# EAGLE schematic revB (EAGLE 9.6.2)
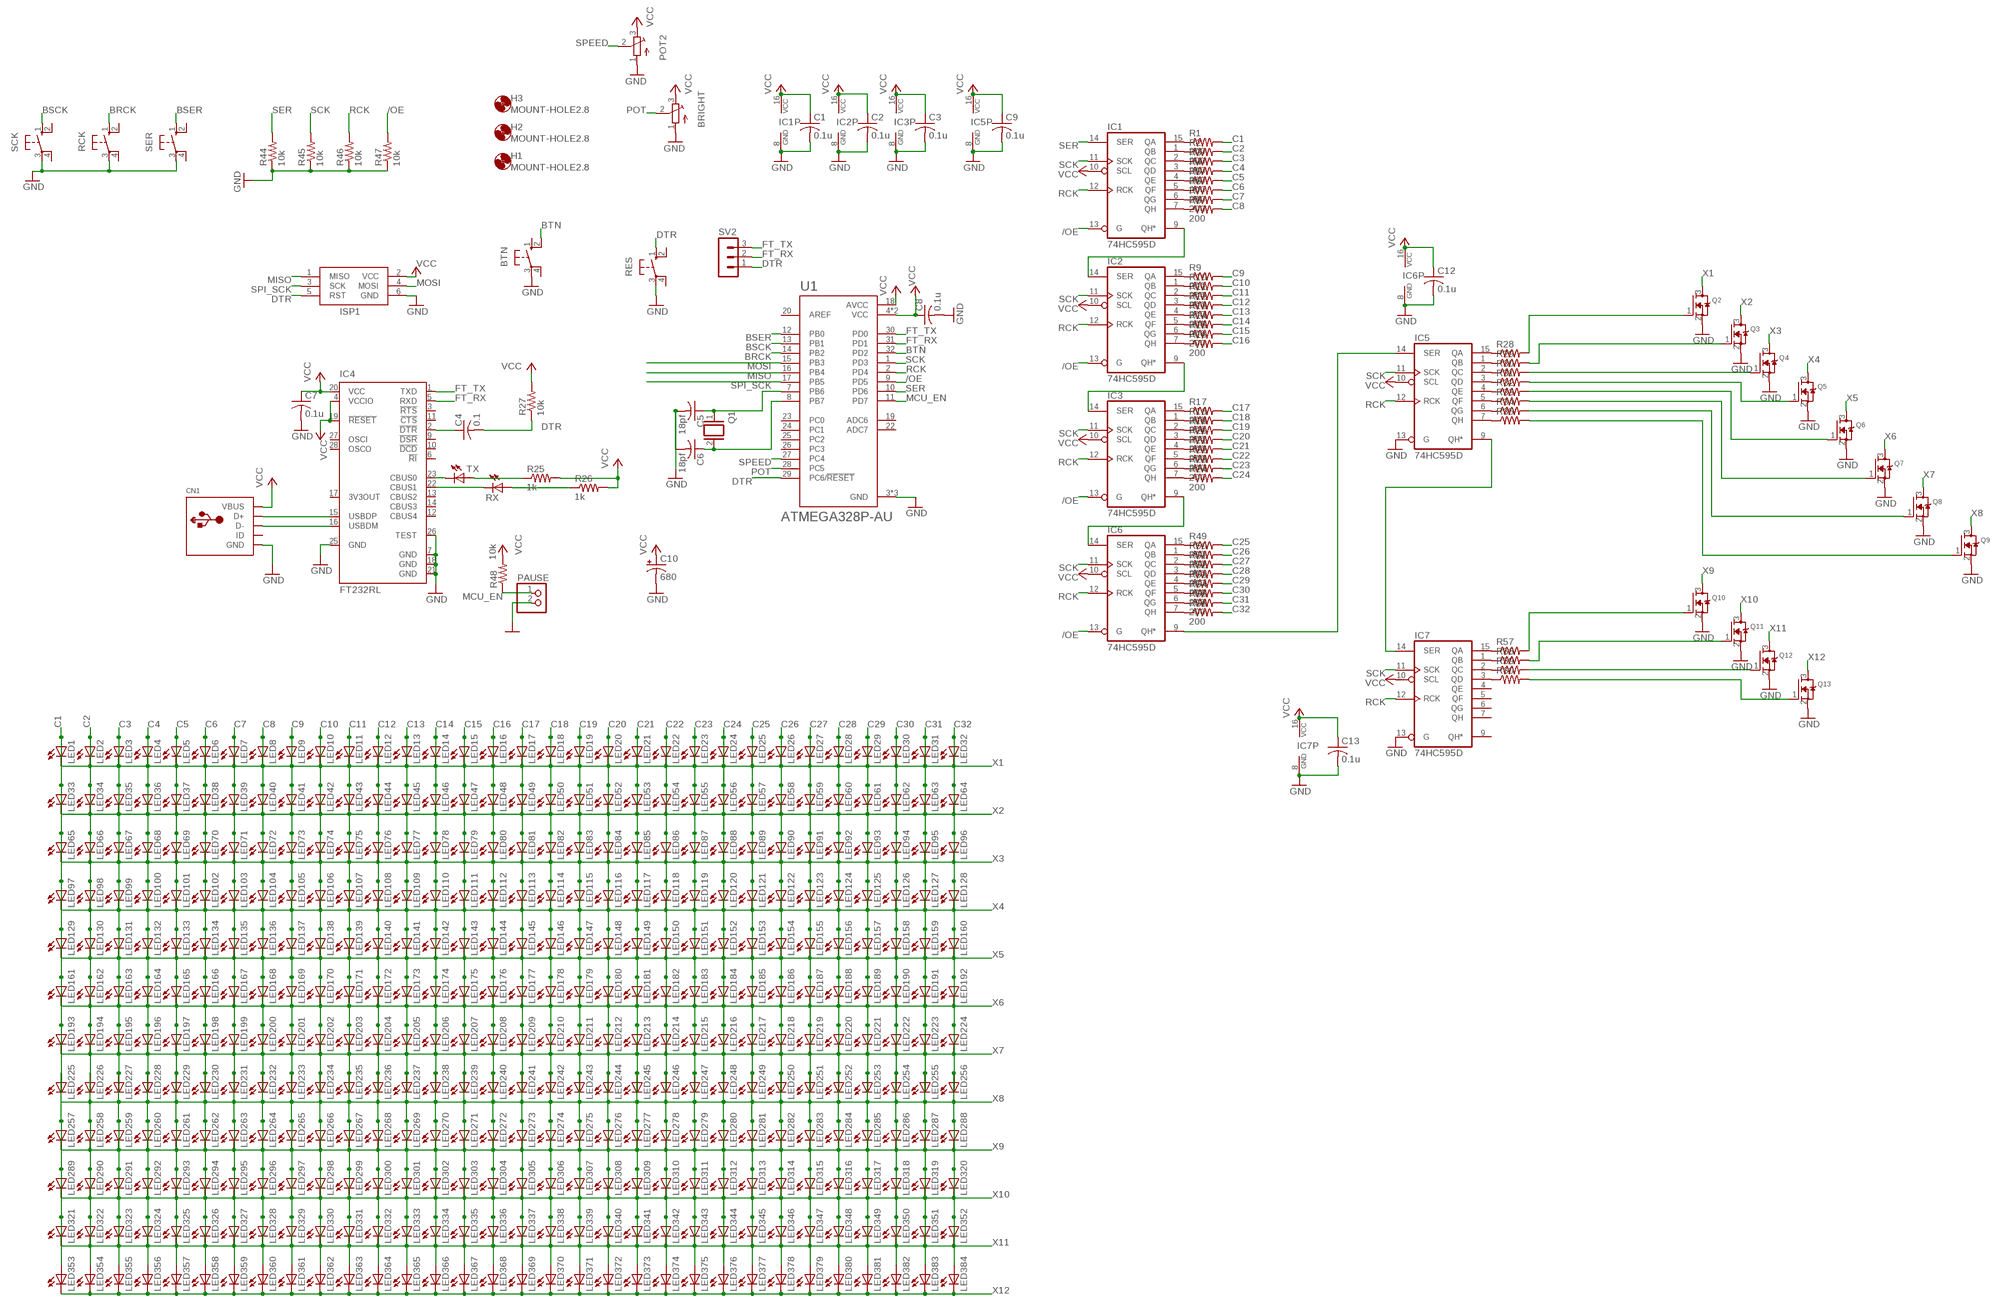
[diagram p0: schematic, sheet 1]

## Parts
BRIGHT  TRIMPOTTC33X  [TC33X]
BTN  10-XX  [B3F-10XX]
C1  0.1u  C-USC0805K  [C0805K]
C2  0.1u  C-USC0805K  [C0805K]
C3  0.1u  C-USC0805K  [C0805K]
C4  0.1  C-USC0805K  [C0805K]
C5  18pf  C-USC0805K  [C0805K]
C6  18pf  C-USC0805K  [C0805K]
C7  0.1u  C-USC0805K  [C0805K]
C8  0.1u  C-USC0805K  [C0805K]
C9  0.1u  C-USC0805K  [C0805K]
C10  680  CPOL-USE3.5-8  [E3,5-8]
C12  0.1u  C-USC0805K  [C0805K]
C13  0.1u  C-USC0805K  [C0805K]
CN1  USBMINIB  [USB-MINIB]
H1  MOUNT-HOLE2.8  [2,8]
H2  MOUNT-HOLE2.8  [2,8]
H3  MOUNT-HOLE2.8  [2,8]
IC1  74HC595D  [SO16]
IC2  74HC595D  [SO16]
IC3  74HC595D  [SO16]
IC4  FT232RL  [SSOP28]
IC5  74HC595D  [SO16]
IC6  74HC595D  [SO16]
IC7  74HC595D  [SO16]
ISP1  AVRISP-6  [AVRISP]
LED1  LEDCHIP-LED0805  [CHIP-LED0805]
LED2  LEDCHIP-LED0805  [CHIP-LED0805]
LED3  LEDCHIP-LED0805  [CHIP-LED0805]
LED4  LEDCHIP-LED0805  [CHIP-LED0805]
LED5  LEDCHIP-LED0805  [CHIP-LED0805]
LED6  LEDCHIP-LED0805  [CHIP-LED0805]
LED7  LEDCHIP-LED0805  [CHIP-LED0805]
LED8  LEDCHIP-LED0805  [CHIP-LED0805]
LED9  LEDCHIP-LED0805  [CHIP-LED0805]
LED10  LEDCHIP-LED0805  [CHIP-LED0805]
LED11  LEDCHIP-LED0805  [CHIP-LED0805]
LED12  LEDCHIP-LED0805  [CHIP-LED0805]
LED13  LEDCHIP-LED0805  [CHIP-LED0805]
LED14  LEDCHIP-LED0805  [CHIP-LED0805]
LED15  LEDCHIP-LED0805  [CHIP-LED0805]
LED16  LEDCHIP-LED0805  [CHIP-LED0805]
LED17  LEDCHIP-LED0805  [CHIP-LED0805]
LED18  LEDCHIP-LED0805  [CHIP-LED0805]
LED19  LEDCHIP-LED0805  [CHIP-LED0805]
LED20  LEDCHIP-LED0805  [CHIP-LED0805]
LED21  LEDCHIP-LED0805  [CHIP-LED0805]
LED22  LEDCHIP-LED0805  [CHIP-LED0805]
LED23  LEDCHIP-LED0805  [CHIP-LED0805]
LED24  LEDCHIP-LED0805  [CHIP-LED0805]
LED25  LEDCHIP-LED0805  [CHIP-LED0805]
LED26  LEDCHIP-LED0805  [CHIP-LED0805]
LED27  LEDCHIP-LED0805  [CHIP-LED0805]
LED28  LEDCHIP-LED0805  [CHIP-LED0805]
LED29  LEDCHIP-LED0805  [CHIP-LED0805]
LED30  LEDCHIP-LED0805  [CHIP-LED0805]
LED31  LEDCHIP-LED0805  [CHIP-LED0805]
LED32  LEDCHIP-LED0805  [CHIP-LED0805]
LED33  LEDCHIP-LED0805  [CHIP-LED0805]
LED34  LEDCHIP-LED0805  [CHIP-LED0805]
LED35  LEDCHIP-LED0805  [CHIP-LED0805]
LED36  LEDCHIP-LED0805  [CHIP-LED0805]
LED37  LEDCHIP-LED0805  [CHIP-LED0805]
LED38  LEDCHIP-LED0805  [CHIP-LED0805]
LED39  LEDCHIP-LED0805  [CHIP-LED0805]
LED40  LEDCHIP-LED0805  [CHIP-LED0805]
LED41  LEDCHIP-LED0805  [CHIP-LED0805]
LED42  LEDCHIP-LED0805  [CHIP-LED0805]
LED43  LEDCHIP-LED0805  [CHIP-LED0805]
LED44  LEDCHIP-LED0805  [CHIP-LED0805]
LED45  LEDCHIP-LED0805  [CHIP-LED0805]
LED46  LEDCHIP-LED0805  [CHIP-LED0805]
LED47  LEDCHIP-LED0805  [CHIP-LED0805]
LED48  LEDCHIP-LED0805  [CHIP-LED0805]
LED49  LEDCHIP-LED0805  [CHIP-LED0805]
LED50  LEDCHIP-LED0805  [CHIP-LED0805]
LED51  LEDCHIP-LED0805  [CHIP-LED0805]
LED52  LEDCHIP-LED0805  [CHIP-LED0805]
LED53  LEDCHIP-LED0805  [CHIP-LED0805]
LED54  LEDCHIP-LED0805  [CHIP-LED0805]
LED55  LEDCHIP-LED0805  [CHIP-LED0805]
LED56  LEDCHIP-LED0805  [CHIP-LED0805]
LED57  LEDCHIP-LED0805  [CHIP-LED0805]
LED58  LEDCHIP-LED0805  [CHIP-LED0805]
LED59  LEDCHIP-LED0805  [CHIP-LED0805]
LED60  LEDCHIP-LED0805  [CHIP-LED0805]
LED61  LEDCHIP-LED0805  [CHIP-LED0805]
LED62  LEDCHIP-LED0805  [CHIP-LED0805]
LED63  LEDCHIP-LED0805  [CHIP-LED0805]
LED64  LEDCHIP-LED0805  [CHIP-LED0805]
LED65  LEDCHIP-LED0805  [CHIP-LED0805]
LED66  LEDCHIP-LED0805  [CHIP-LED0805]
LED67  LEDCHIP-LED0805  [CHIP-LED0805]
LED68  LEDCHIP-LED0805  [CHIP-LED0805]
LED69  LEDCHIP-LED0805  [CHIP-LED0805]
LED70  LEDCHIP-LED0805  [CHIP-LED0805]
LED71  LEDCHIP-LED0805  [CHIP-LED0805]
LED72  LEDCHIP-LED0805  [CHIP-LED0805]
LED73  LEDCHIP-LED0805  [CHIP-LED0805]
LED74  LEDCHIP-LED0805  [CHIP-LED0805]
LED75  LEDCHIP-LED0805  [CHIP-LED0805]
LED76  LEDCHIP-LED0805  [CHIP-LED0805]
LED77  LEDCHIP-LED0805  [CHIP-LED0805]
LED78  LEDCHIP-LED0805  [CHIP-LED0805]
LED79  LEDCHIP-LED0805  [CHIP-LED0805]
LED80  LEDCHIP-LED0805  [CHIP-LED0805]
LED81  LEDCHIP-LED0805  [CHIP-LED0805]
LED82  LEDCHIP-LED0805  [CHIP-LED0805]
LED83  LEDCHIP-LED0805  [CHIP-LED0805]
LED84  LEDCHIP-LED0805  [CHIP-LED0805]
LED85  LEDCHIP-LED0805  [CHIP-LED0805]
LED86  LEDCHIP-LED0805  [CHIP-LED0805]
LED87  LEDCHIP-LED0805  [CHIP-LED0805]
LED88  LEDCHIP-LED0805  [CHIP-LED0805]
LED89  LEDCHIP-LED0805  [CHIP-LED0805]
LED90  LEDCHIP-LED0805  [CHIP-LED0805]
LED91  LEDCHIP-LED0805  [CHIP-LED0805]
LED92  LEDCHIP-LED0805  [CHIP-LED0805]
LED93  LEDCHIP-LED0805  [CHIP-LED0805]
LED94  LEDCHIP-LED0805  [CHIP-LED0805]
LED95  LEDCHIP-LED0805  [CHIP-LED0805]
LED96  LEDCHIP-LED0805  [CHIP-LED0805]
LED97  LEDCHIP-LED0805  [CHIP-LED0805]
LED98  LEDCHIP-LED0805  [CHIP-LED0805]
LED99  LEDCHIP-LED0805  [CHIP-LED0805]
LED100  LEDCHIP-LED0805  [CHIP-LED0805]
LED101  LEDCHIP-LED0805  [CHIP-LED0805]
LED102  LEDCHIP-LED0805  [CHIP-LED0805]
LED103  LEDCHIP-LED0805  [CHIP-LED0805]
LED104  LEDCHIP-LED0805  [CHIP-LED0805]
LED105  LEDCHIP-LED0805  [CHIP-LED0805]
LED106  LEDCHIP-LED0805  [CHIP-LED0805]
LED107  LEDCHIP-LED0805  [CHIP-LED0805]
LED108  LEDCHIP-LED0805  [CHIP-LED0805]
LED109  LEDCHIP-LED0805  [CHIP-LED0805]
LED110  LEDCHIP-LED0805  [CHIP-LED0805]
LED111  LEDCHIP-LED0805  [CHIP-LED0805]
LED112  LEDCHIP-LED0805  [CHIP-LED0805]
LED113  LEDCHIP-LED0805  [CHIP-LED0805]
LED114  LEDCHIP-LED0805  [CHIP-LED0805]
LED115  LEDCHIP-LED0805  [CHIP-LED0805]
LED116  LEDCHIP-LED0805  [CHIP-LED0805]
LED117  LEDCHIP-LED0805  [CHIP-LED0805]
LED118  LEDCHIP-LED0805  [CHIP-LED0805]
LED119  LEDCHIP-LED0805  [CHIP-LED0805]
LED120  LEDCHIP-LED0805  [CHIP-LED0805]
LED121  LEDCHIP-LED0805  [CHIP-LED0805]
LED122  LEDCHIP-LED0805  [CHIP-LED0805]
LED123  LEDCHIP-LED0805  [CHIP-LED0805]
LED124  LEDCHIP-LED0805  [CHIP-LED0805]
LED125  LEDCHIP-LED0805  [CHIP-LED0805]
LED126  LEDCHIP-LED0805  [CHIP-LED0805]
LED127  LEDCHIP-LED0805  [CHIP-LED0805]
LED128  LEDCHIP-LED0805  [CHIP-LED0805]
LED129  LEDCHIP-LED0805  [CHIP-LED0805]
LED130  LEDCHIP-LED0805  [CHIP-LED0805]
LED131  LEDCHIP-LED0805  [CHIP-LED0805]
LED132  LEDCHIP-LED0805  [CHIP-LED0805]
LED133  LEDCHIP-LED0805  [CHIP-LED0805]
LED134  LEDCHIP-LED0805  [CHIP-LED0805]
LED135  LEDCHIP-LED0805  [CHIP-LED0805]
LED136  LEDCHIP-LED0805  [CHIP-LED0805]
LED137  LEDCHIP-LED0805  [CHIP-LED0805]
LED138  LEDCHIP-LED0805  [CHIP-LED0805]
LED139  LEDCHIP-LED0805  [CHIP-LED0805]
LED140  LEDCHIP-LED0805  [CHIP-LED0805]
LED141  LEDCHIP-LED0805  [CHIP-LED0805]
LED142  LEDCHIP-LED0805  [CHIP-LED0805]
LED143  LEDCHIP-LED0805  [CHIP-LED0805]
LED144  LEDCHIP-LED0805  [CHIP-LED0805]
LED145  LEDCHIP-LED0805  [CHIP-LED0805]
LED146  LEDCHIP-LED0805  [CHIP-LED0805]
LED147  LEDCHIP-LED0805  [CHIP-LED0805]
LED148  LEDCHIP-LED0805  [CHIP-LED0805]
LED149  LEDCHIP-LED0805  [CHIP-LED0805]
LED150  LEDCHIP-LED0805  [CHIP-LED0805]
LED151  LEDCHIP-LED0805  [CHIP-LED0805]
LED152  LEDCHIP-LED0805  [CHIP-LED0805]
LED153  LEDCHIP-LED0805  [CHIP-LED0805]
LED154  LEDCHIP-LED0805  [CHIP-LED0805]
LED155  LEDCHIP-LED0805  [CHIP-LED0805]
LED156  LEDCHIP-LED0805  [CHIP-LED0805]
LED157  LEDCHIP-LED0805  [CHIP-LED0805]
LED158  LEDCHIP-LED0805  [CHIP-LED0805]
LED159  LEDCHIP-LED0805  [CHIP-LED0805]
LED160  LEDCHIP-LED0805  [CHIP-LED0805]
LED161  LEDCHIP-LED0805  [CHIP-LED0805]
LED162  LEDCHIP-LED0805  [CHIP-LED0805]
LED163  LEDCHIP-LED0805  [CHIP-LED0805]
LED164  LEDCHIP-LED0805  [CHIP-LED0805]
LED165  LEDCHIP-LED0805  [CHIP-LED0805]
LED166  LEDCHIP-LED0805  [CHIP-LED0805]
LED167  LEDCHIP-LED0805  [CHIP-LED0805]
LED168  LEDCHIP-LED0805  [CHIP-LED0805]
LED169  LEDCHIP-LED0805  [CHIP-LED0805]
LED170  LEDCHIP-LED0805  [CHIP-LED0805]
LED171  LEDCHIP-LED0805  [CHIP-LED0805]
LED172  LEDCHIP-LED0805  [CHIP-LED0805]
LED173  LEDCHIP-LED0805  [CHIP-LED0805]
LED174  LEDCHIP-LED0805  [CHIP-LED0805]
LED175  LEDCHIP-LED0805  [CHIP-LED0805]
LED176  LEDCHIP-LED0805  [CHIP-LED0805]
LED177  LEDCHIP-LED0805  [CHIP-LED0805]
LED178  LEDCHIP-LED0805  [CHIP-LED0805]
LED179  LEDCHIP-LED0805  [CHIP-LED0805]
LED180  LEDCHIP-LED0805  [CHIP-LED0805]
LED181  LEDCHIP-LED0805  [CHIP-LED0805]
LED182  LEDCHIP-LED0805  [CHIP-LED0805]
LED183  LEDCHIP-LED0805  [CHIP-LED0805]
LED184  LEDCHIP-LED0805  [CHIP-LED0805]
LED185  LEDCHIP-LED0805  [CHIP-LED0805]
LED186  LEDCHIP-LED0805  [CHIP-LED0805]
LED187  LEDCHIP-LED0805  [CHIP-LED0805]
LED188  LEDCHIP-LED0805  [CHIP-LED0805]
LED189  LEDCHIP-LED0805  [CHIP-LED0805]
LED190  LEDCHIP-LED0805  [CHIP-LED0805]
LED191  LEDCHIP-LED0805  [CHIP-LED0805]
LED192  LEDCHIP-LED0805  [CHIP-LED0805]
LED193  LEDCHIP-LED0805  [CHIP-LED0805]
LED194  LEDCHIP-LED0805  [CHIP-LED0805]
LED195  LEDCHIP-LED0805  [CHIP-LED0805]
LED196  LEDCHIP-LED0805  [CHIP-LED0805]
LED197  LEDCHIP-LED0805  [CHIP-LED0805]
LED198  LEDCHIP-LED0805  [CHIP-LED0805]
LED199  LEDCHIP-LED0805  [CHIP-LED0805]
LED200  LEDCHIP-LED0805  [CHIP-LED0805]
LED201  LEDCHIP-LED0805  [CHIP-LED0805]
LED202  LEDCHIP-LED0805  [CHIP-LED0805]
LED203  LEDCHIP-LED0805  [CHIP-LED0805]
LED204  LEDCHIP-LED0805  [CHIP-LED0805]
LED205  LEDCHIP-LED0805  [CHIP-LED0805]
LED206  LEDCHIP-LED0805  [CHIP-LED0805]
LED207  LEDCHIP-LED0805  [CHIP-LED0805]
LED208  LEDCHIP-LED0805  [CHIP-LED0805]
LED209  LEDCHIP-LED0805  [CHIP-LED0805]
LED210  LEDCHIP-LED0805  [CHIP-LED0805]
LED211  LEDCHIP-LED0805  [CHIP-LED0805]
LED212  LEDCHIP-LED0805  [CHIP-LED0805]
LED213  LEDCHIP-LED0805  [CHIP-LED0805]
LED214  LEDCHIP-LED0805  [CHIP-LED0805]
LED215  LEDCHIP-LED0805  [CHIP-LED0805]
LED216  LEDCHIP-LED0805  [CHIP-LED0805]
LED217  LEDCHIP-LED0805  [CHIP-LED0805]
LED218  LEDCHIP-LED0805  [CHIP-LED0805]
LED219  LEDCHIP-LED0805  [CHIP-LED0805]
LED220  LEDCHIP-LED0805  [CHIP-LED0805]
LED221  LEDCHIP-LED0805  [CHIP-LED0805]
LED222  LEDCHIP-LED0805  [CHIP-LED0805]
LED223  LEDCHIP-LED0805  [CHIP-LED0805]
LED224  LEDCHIP-LED0805  [CHIP-LED0805]
LED225  LEDCHIP-LED0805  [CHIP-LED0805]
LED226  LEDCHIP-LED0805  [CHIP-LED0805]
LED227  LEDCHIP-LED0805  [CHIP-LED0805]
LED228  LEDCHIP-LED0805  [CHIP-LED0805]
LED229  LEDCHIP-LED0805  [CHIP-LED0805]
LED230  LEDCHIP-LED0805  [CHIP-LED0805]
LED231  LEDCHIP-LED0805  [CHIP-LED0805]
LED232  LEDCHIP-LED0805  [CHIP-LED0805]
LED233  LEDCHIP-LED0805  [CHIP-LED0805]
LED234  LEDCHIP-LED0805  [CHIP-LED0805]
LED235  LEDCHIP-LED0805  [CHIP-LED0805]
LED236  LEDCHIP-LED0805  [CHIP-LED0805]
LED237  LEDCHIP-LED0805  [CHIP-LED0805]
LED238  LEDCHIP-LED0805  [CHIP-LED0805]
LED239  LEDCHIP-LED0805  [CHIP-LED0805]
LED240  LEDCHIP-LED0805  [CHIP-LED0805]
LED241  LEDCHIP-LED0805  [CHIP-LED0805]
LED242  LEDCHIP-LED0805  [CHIP-LED0805]
LED243  LEDCHIP-LED0805  [CHIP-LED0805]
LED244  LEDCHIP-LED0805  [CHIP-LED0805]
LED245  LEDCHIP-LED0805  [CHIP-LED0805]
LED246  LEDCHIP-LED0805  [CHIP-LED0805]
LED247  LEDCHIP-LED0805  [CHIP-LED0805]
LED248  LEDCHIP-LED0805  [CHIP-LED0805]
LED249  LEDCHIP-LED0805  [CHIP-LED0805]
LED250  LEDCHIP-LED0805  [CHIP-LED0805]
LED251  LEDCHIP-LED0805  [CHIP-LED0805]
LED252  LEDCHIP-LED0805  [CHIP-LED0805]
LED253  LEDCHIP-LED0805  [CHIP-LED0805]
LED254  LEDCHIP-LED0805  [CHIP-LED0805]
LED255  LEDCHIP-LED0805  [CHIP-LED0805]
LED256  LEDCHIP-LED0805  [CHIP-LED0805]
LED257  LEDCHIP-LED0805  [CHIP-LED0805]
LED258  LEDCHIP-LED0805  [CHIP-LED0805]
LED259  LEDCHIP-LED0805  [CHIP-LED0805]
LED260  LEDCHIP-LED0805  [CHIP-LED0805]
LED261  LEDCHIP-LED0805  [CHIP-LED0805]
LED262  LEDCHIP-LED0805  [CHIP-LED0805]
LED263  LEDCHIP-LED0805  [CHIP-LED0805]
LED264  LEDCHIP-LED0805  [CHIP-LED0805]
LED265  LEDCHIP-LED0805  [CHIP-LED0805]
LED266  LEDCHIP-LED0805  [CHIP-LED0805]
LED267  LEDCHIP-LED0805  [CHIP-LED0805]
LED268  LEDCHIP-LED0805  [CHIP-LED0805]
LED269  LEDCHIP-LED0805  [CHIP-LED0805]
LED270  LEDCHIP-LED0805  [CHIP-LED0805]
LED271  LEDCHIP-LED0805  [CHIP-LED0805]
LED272  LEDCHIP-LED0805  [CHIP-LED0805]
LED273  LEDCHIP-LED0805  [CHIP-LED0805]
LED274  LEDCHIP-LED0805  [CHIP-LED0805]
LED275  LEDCHIP-LED0805  [CHIP-LED0805]
LED276  LEDCHIP-LED0805  [CHIP-LED0805]
LED277  LEDCHIP-LED0805  [CHIP-LED0805]
LED278  LEDCHIP-LED0805  [CHIP-LED0805]
LED279  LEDCHIP-LED0805  [CHIP-LED0805]
LED280  LEDCHIP-LED0805  [CHIP-LED0805]
LED281  LEDCHIP-LED0805  [CHIP-LED0805]
LED282  LEDCHIP-LED0805  [CHIP-LED0805]
LED283  LEDCHIP-LED0805  [CHIP-LED0805]
LED284  LEDCHIP-LED0805  [CHIP-LED0805]
LED285  LEDCHIP-LED0805  [CHIP-LED0805]
LED286  LEDCHIP-LED0805  [CHIP-LED0805]
LED287  LEDCHIP-LED0805  [CHIP-LED0805]
LED288  LEDCHIP-LED0805  [CHIP-LED0805]
LED289  LEDCHIP-LED0805  [CHIP-LED0805]
LED290  LEDCHIP-LED0805  [CHIP-LED0805]
LED291  LEDCHIP-LED0805  [CHIP-LED0805]
LED292  LEDCHIP-LED0805  [CHIP-LED0805]
LED293  LEDCHIP-LED0805  [CHIP-LED0805]
LED294  LEDCHIP-LED0805  [CHIP-LED0805]
LED295  LEDCHIP-LED0805  [CHIP-LED0805]
LED296  LEDCHIP-LED0805  [CHIP-LED0805]
LED297  LEDCHIP-LED0805  [CHIP-LED0805]
LED298  LEDCHIP-LED0805  [CHIP-LED0805]
LED299  LEDCHIP-LED0805  [CHIP-LED0805]
LED300  LEDCHIP-LED0805  [CHIP-LED0805]
LED301  LEDCHIP-LED0805  [CHIP-LED0805]
LED302  LEDCHIP-LED0805  [CHIP-LED0805]
LED303  LEDCHIP-LED0805  [CHIP-LED0805]
LED304  LEDCHIP-LED0805  [CHIP-LED0805]
LED305  LEDCHIP-LED0805  [CHIP-LED0805]
LED306  LEDCHIP-LED0805  [CHIP-LED0805]
LED307  LEDCHIP-LED0805  [CHIP-LED0805]
LED308  LEDCHIP-LED0805  [CHIP-LED0805]
LED309  LEDCHIP-LED0805  [CHIP-LED0805]
LED310  LEDCHIP-LED0805  [CHIP-LED0805]
LED311  LEDCHIP-LED0805  [CHIP-LED0805]
LED312  LEDCHIP-LED0805  [CHIP-LED0805]
LED313  LEDCHIP-LED0805  [CHIP-LED0805]
LED314  LEDCHIP-LED0805  [CHIP-LED0805]
LED315  LEDCHIP-LED0805  [CHIP-LED0805]
LED316  LEDCHIP-LED0805  [CHIP-LED0805]
LED317  LEDCHIP-LED0805  [CHIP-LED0805]
LED318  LEDCHIP-LED0805  [CHIP-LED0805]
LED319  LEDCHIP-LED0805  [CHIP-LED0805]
LED320  LEDCHIP-LED0805  [CHIP-LED0805]
LED321  LEDCHIP-LED0805  [CHIP-LED0805]
LED322  LEDCHIP-LED0805  [CHIP-LED0805]
LED323  LEDCHIP-LED0805  [CHIP-LED0805]
LED324  LEDCHIP-LED0805  [CHIP-LED0805]
LED325  LEDCHIP-LED0805  [CHIP-LED0805]
LED326  LEDCHIP-LED0805  [CHIP-LED0805]
LED327  LEDCHIP-LED0805  [CHIP-LED0805]
LED328  LEDCHIP-LED0805  [CHIP-LED0805]
LED329  LEDCHIP-LED0805  [CHIP-LED0805]
LED330  LEDCHIP-LED0805  [CHIP-LED0805]
LED331  LEDCHIP-LED0805  [CHIP-LED0805]
LED332  LEDCHIP-LED0805  [CHIP-LED0805]
LED333  LEDCHIP-LED0805  [CHIP-LED0805]
LED334  LEDCHIP-LED0805  [CHIP-LED0805]
LED335  LEDCHIP-LED0805  [CHIP-LED0805]
LED336  LEDCHIP-LED0805  [CHIP-LED0805]
LED337  LEDCHIP-LED0805  [CHIP-LED0805]
LED338  LEDCHIP-LED0805  [CHIP-LED0805]
LED339  LEDCHIP-LED0805  [CHIP-LED0805]
LED340  LEDCHIP-LED0805  [CHIP-LED0805]
LED341  LEDCHIP-LED0805  [CHIP-LED0805]
LED342  LEDCHIP-LED0805  [CHIP-LED0805]
LED343  LEDCHIP-LED0805  [CHIP-LED0805]
LED344  LEDCHIP-LED0805  [CHIP-LED0805]
LED345  LEDCHIP-LED0805  [CHIP-LED0805]
LED346  LEDCHIP-LED0805  [CHIP-LED0805]
LED347  LEDCHIP-LED0805  [CHIP-LED0805]
LED348  LEDCHIP-LED0805  [CHIP-LED0805]
LED349  LEDCHIP-LED0805  [CHIP-LED0805]
LED350  LEDCHIP-LED0805  [CHIP-LED0805]
LED351  LEDCHIP-LED0805  [CHIP-LED0805]
LED352  LEDCHIP-LED0805  [CHIP-LED0805]
LED353  LEDCHIP-LED0805  [CHIP-LED0805]
LED354  LEDCHIP-LED0805  [CHIP-LED0805]
LED355  LEDCHIP-LED0805  [CHIP-LED0805]
LED356  LEDCHIP-LED0805  [CHIP-LED0805]
LED357  LEDCHIP-LED0805  [CHIP-LED0805]
LED358  LEDCHIP-LED0805  [CHIP-LED0805]
LED359  LEDCHIP-LED0805  [CHIP-LED0805]
LED360  LEDCHIP-LED0805  [CHIP-LED0805]
LED361  LEDCHIP-LED0805  [CHIP-LED0805]
LED362  LEDCHIP-LED0805  [CHIP-LED0805]
LED363  LEDCHIP-LED0805  [CHIP-LED0805]
LED364  LEDCHIP-LED0805  [CHIP-LED0805]
LED365  LEDCHIP-LED0805  [CHIP-LED0805]
LED366  LEDCHIP-LED0805  [CHIP-LED0805]
LED367  LEDCHIP-LED0805  [CHIP-LED0805]
LED368  LEDCHIP-LED0805  [CHIP-LED0805]
LED369  LEDCHIP-LED0805  [CHIP-LED0805]
LED370  LEDCHIP-LED0805  [CHIP-LED0805]
LED371  LEDCHIP-LED0805  [CHIP-LED0805]
LED372  LEDCHIP-LED0805  [CHIP-LED0805]
LED373  LEDCHIP-LED0805  [CHIP-LED0805]
LED374  LEDCHIP-LED0805  [CHIP-LED0805]
LED375  LEDCHIP-LED0805  [CHIP-LED0805]
LED376  LEDCHIP-LED0805  [CHIP-LED0805]
LED377  LEDCHIP-LED0805  [CHIP-LED0805]
LED378  LEDCHIP-LED0805  [CHIP-LED0805]
LED379  LEDCHIP-LED0805  [CHIP-LED0805]
LED380  LEDCHIP-LED0805  [CHIP-LED0805]
LED381  LEDCHIP-LED0805  [CHIP-LED0805]
LED382  LEDCHIP-LED0805  [CHIP-LED0805]
LED383  LEDCHIP-LED0805  [CHIP-LED0805]
LED384  LEDCHIP-LED0805  [CHIP-LED0805]
PAUSE  PINHD-1X2  [1X02]
POT2  TRIMPOTTC33X  [TC33X]
Q1  XTAL/S  [QS]
Q2  MOSFET-NREFLOW  [SOT23]
Q3  MOSFET-NREFLOW  [SOT23]
Q4  MOSFET-NREFLOW  [SOT23]
Q5  MOSFET-NREFLOW  [SOT23]
Q6  MOSFET-NREFLOW  [SOT23]
Q7  MOSFET-NREFLOW  [SOT23]
Q8  MOSFET-NREFLOW  [SOT23]
Q9  MOSFET-NREFLOW  [SOT23]
Q10  MOSFET-NREFLOW  [SOT23]
Q11  MOSFET-NREFLOW  [SOT23]
Q12  MOSFET-NREFLOW  [SOT23]
Q13  MOSFET-NREFLOW  [SOT23]
R1  200  R-US_R0805  [R0805]
R2  200  R-US_R0805  [R0805]
R3  200  R-US_R0805  [R0805]
R4  200  R-US_R0805  [R0805]
R5  200  R-US_R0805  [R0805]
R6  200  R-US_R0805  [R0805]
R7  200  R-US_R0805  [R0805]
R8  200  R-US_R0805  [R0805]
R9  200  R-US_R0805  [R0805]
R10  200  R-US_R0805  [R0805]
R11  200  R-US_R0805  [R0805]
R12  200  R-US_R0805  [R0805]
R13  200  R-US_R0805  [R0805]
R14  200  R-US_R0805  [R0805]
R15  200  R-US_R0805  [R0805]
R16  200  R-US_R0805  [R0805]
R17  200  R-US_R0805  [R0805]
R18  200  R-US_R0805  [R0805]
R19  200  R-US_R0805  [R0805]
R20  200  R-US_R0805  [R0805]
R21  200  R-US_R0805  [R0805]
R22  200  R-US_R0805  [R0805]
R23  200  R-US_R0805  [R0805]
R24  200  R-US_R0805  [R0805]
R25  1k  R-US_R0805  [R0805]
R26  1k  R-US_R0805  [R0805]
R27  10k  R-US_R0805  [R0805]
R28  R-US_R0805  [R0805]
R29  R-US_R0805  [R0805]
R30  R-US_R0805  [R0805]
R31  R-US_R0805  [R0805]
R32  R-US_R0805  [R0805]
R33  R-US_R0805  [R0805]
R34  R-US_R0805  [R0805]
R35  R-US_R0805  [R0805]
R44  10k  R-US_R0805  [R0805]
R45  10k  R-US_R0805  [R0805]
R46  10k  R-US_R0805  [R0805]
R47  10k  R-US_R0805  [R0805]
R48  10k  R-US_R0805  [R0805]
R49  200  R-US_R0805  [R0805]
R50  200  R-US_R0805  [R0805]
R51  200  R-US_R0805  [R0805]
R52  200  R-US_R0805  [R0805]
R53  200  R-US_R0805  [R0805]
R54  200  R-US_R0805  [R0805]
R55  200  R-US_R0805  [R0805]
R56  200  R-US_R0805  [R0805]
R57  R-US_R0805  [R0805]
R58  R-US_R0805  [R0805]
R59  R-US_R0805  [R0805]
R60  R-US_R0805  [R0805]
RCK  10-XX  [B3F-10XX]
RES  10-XX  [B3F-10XX]
RX  LEDCHIPLED_0805  [CHIPLED_0805]
SCK  10-XX  [B3F-10XX]
SER  10-XX  [B3F-10XX]
SV2  MA03-1  [MA03-1]
TX  LEDCHIPLED_0805  [CHIPLED_0805]
U1  ATMEGA328P-AU  [QFP80P900X900X120-32N]

## Nets
/OE: IC1.13(G) IC2.13(G) IC3.13(G) IC6.13(G) R47.2 U1.9(PD5)
BRCK: RCK.1(S) U1.14(PB2)
BSCK: SCK.1(S) U1.13(PB1)
BSER: SER.1(S) U1.12(PB0)
BTN: BTN.2(S1) U1.32(PD2)
C1: LED1.A LED33.A LED65.A LED97.A LED129.A LED161.A LED193.A LED225.A LED257.A LED289.A LED321.A LED353.A R1.2
C2: LED2.A LED34.A LED66.A LED98.A LED130.A LED162.A LED194.A LED226.A LED258.A LED290.A LED322.A LED354.A R2.2
C3: LED3.A LED35.A LED67.A LED99.A LED131.A LED163.A LED195.A LED227.A LED259.A LED291.A LED323.A LED355.A R3.2
C4: LED4.A LED36.A LED68.A LED100.A LED132.A LED164.A LED196.A LED228.A LED260.A LED292.A LED324.A LED356.A R4.2
C5: LED5.A LED37.A LED69.A LED101.A LED133.A LED165.A LED197.A LED229.A LED261.A LED293.A LED325.A LED357.A R5.2
C6: LED6.A LED38.A LED70.A LED102.A LED134.A LED166.A LED198.A LED230.A LED262.A LED294.A LED326.A LED358.A R6.2
C7: LED7.A LED39.A LED71.A LED103.A LED135.A LED167.A LED199.A LED231.A LED263.A LED295.A LED327.A LED359.A R7.2
C8: LED8.A LED40.A LED72.A LED104.A LED136.A LED168.A LED200.A LED232.A LED264.A LED296.A LED328.A LED360.A R8.2
C9: LED9.A LED41.A LED73.A LED105.A LED137.A LED169.A LED201.A LED233.A LED265.A LED297.A LED329.A LED361.A R9.2
C10: LED10.A LED42.A LED74.A LED106.A LED138.A LED170.A LED202.A LED234.A LED266.A LED298.A LED330.A LED362.A R10.2
C11: LED11.A LED43.A LED75.A LED107.A LED139.A LED171.A LED203.A LED235.A LED267.A LED299.A LED331.A LED363.A R11.2
C12: LED12.A LED44.A LED76.A LED108.A LED140.A LED172.A LED204.A LED236.A LED268.A LED300.A LED332.A LED364.A R12.2
C13: LED13.A LED45.A LED77.A LED109.A LED141.A LED173.A LED205.A LED237.A LED269.A LED301.A LED333.A LED365.A R13.2
C14: LED14.A LED46.A LED78.A LED110.A LED142.A LED174.A LED206.A LED238.A LED270.A LED302.A LED334.A LED366.A R14.2
C15: LED15.A LED47.A LED79.A LED111.A LED143.A LED175.A LED207.A LED239.A LED271.A LED303.A LED335.A LED367.A R15.2
C16: LED16.A LED48.A LED80.A LED112.A LED144.A LED176.A LED208.A LED240.A LED272.A LED304.A LED336.A LED368.A R16.2
C17: LED17.A LED49.A LED81.A LED113.A LED145.A LED177.A LED209.A LED241.A LED273.A LED305.A LED337.A LED369.A R17.2
C18: LED18.A LED50.A LED82.A LED114.A LED146.A LED178.A LED210.A LED242.A LED274.A LED306.A LED338.A LED370.A R18.2
C19: LED19.A LED51.A LED83.A LED115.A LED147.A LED179.A LED211.A LED243.A LED275.A LED307.A LED339.A LED371.A R19.2
C20: LED20.A LED52.A LED84.A LED116.A LED148.A LED180.A LED212.A LED244.A LED276.A LED308.A LED340.A LED372.A R20.2
C21: LED21.A LED53.A LED85.A LED117.A LED149.A LED181.A LED213.A LED245.A LED277.A LED309.A LED341.A LED373.A R21.2
C22: LED22.A LED54.A LED86.A LED118.A LED150.A LED182.A LED214.A LED246.A LED278.A LED310.A LED342.A LED374.A R22.2
C23: LED23.A LED55.A LED87.A LED119.A LED151.A LED183.A LED215.A LED247.A LED279.A LED311.A LED343.A LED375.A R23.2
C24: LED24.A LED56.A LED88.A LED120.A LED152.A LED184.A LED216.A LED248.A LED280.A LED312.A LED344.A LED376.A R24.2
C25: LED25.A LED57.A LED89.A LED121.A LED153.A LED185.A LED217.A LED249.A LED281.A LED313.A LED345.A LED377.A R49.2
C26: LED26.A LED58.A LED90.A LED122.A LED154.A LED186.A LED218.A LED250.A LED282.A LED314.A LED346.A LED378.A R50.2
C27: LED27.A LED59.A LED91.A LED123.A LED155.A LED187.A LED219.A LED251.A LED283.A LED315.A LED347.A LED379.A R51.2
C28: LED28.A LED60.A LED92.A LED124.A LED156.A LED188.A LED220.A LED252.A LED284.A LED316.A LED348.A LED380.A R52.2
C29: LED29.A LED61.A LED93.A LED125.A LED157.A LED189.A LED221.A LED253.A LED285.A LED317.A LED349.A LED381.A R53.2
C30: LED30.A LED62.A LED94.A LED126.A LED158.A LED190.A LED222.A LED254.A LED286.A LED318.A LED350.A LED382.A R54.2
C31: LED31.A LED63.A LED95.A LED127.A LED159.A LED191.A LED223.A LED255.A LED287.A LED319.A LED351.A LED383.A R55.2
C32: LED32.A LED64.A LED96.A LED128.A LED160.A LED192.A LED224.A LED256.A LED288.A LED320.A LED352.A LED384.A R56.2
DTR: C4.2 ISP1.5(RST) R27.1 RES.1(S) SV2.1 U1.29(PC6/!RESET)
FT_RX: IC4.5(RXD) SV2.2 U1.31(PD1)
FT_TX: IC4.1(TXD) SV2.3 U1.30(PD0)
GND: BRIGHT.1(A) BTN.3(P) C1.2 C2.2 C3.2 C5.2 C6.2 C7.2 C8.2 C9.2 C10.- C12.2 C13.2 CN1.GND IC1.8(GND) IC2.8(GND) IC3.8(GND) IC4.7(GND) IC4.18(GND) IC4.21(GND) IC4.25(GND) IC4.26(TEST) IC5.8(GND) IC5.13(G) IC6.8(GND) IC7.8(GND) IC7.13(G) ISP1.6(GND) PAUSE.2 POT2.1(A) Q2.2(S) Q3.2(S) Q4.2(S) Q5.2(S) Q6.2(S) Q7.2(S) Q8.2(S) Q9.2(S) Q10.2(S) Q11.2(S) Q12.2(S) Q13.2(S) R44.1 R45.1 R46.1 R47.1 RCK.3(P) RES.3(P) SCK.3(P) SER.3(P) U1.3(GND) U1.5(GND) U1.21(GND)
MCU_EN: PAUSE.1 R48.1 U1.11(PD7)
MISO: ISP1.1(MISO) U1.16(PB4)
MOSI: ISP1.4(MOSI) U1.15(PB3)
N$1: IC1.9(QH*) IC2.14(SER)
N$2: IC1.15(QA) R1.1
N$3: IC1.1(QB) R2.1
N$4: IC1.2(QC) R3.1
N$5: IC1.3(QD) R4.1
N$6: IC1.4(QE) R5.1
N$7: IC1.5(QF) R6.1
N$8: IC1.6(QG) R7.1
N$9: IC1.7(QH) R8.1
N$10: IC2.15(QA) R9.1
N$11: IC2.1(QB) R10.1
N$12: IC2.2(QC) R11.1
N$13: IC2.3(QD) R12.1
N$14: IC2.4(QE) R13.1
N$15: IC2.5(QF) R14.1
N$16: IC2.6(QG) R15.1
N$17: IC2.7(QH) R16.1
N$18: IC2.9(QH*) IC3.14(SER)
N$19: IC3.15(QA) R17.1
N$20: IC3.1(QB) R18.1
N$21: IC3.2(QC) R19.1
N$22: IC3.3(QD) R20.1
N$23: IC3.4(QE) R21.1
N$24: IC3.5(QF) R22.1
N$25: IC3.6(QG) R23.1
N$26: IC3.7(QH) R24.1
N$27: CN1.D+ IC4.15(USBDP)
N$28: CN1.D- IC4.16(USBDM)
N$29: IC4.23(CBUS0) TX.C
N$30: IC4.22(CBUS1) RX.C
N$31: R25.1 TX.A
N$32: R26.1 RX.A
N$33: C6.1 Q1.2 U1.8(PB7)
N$34: C5.1 Q1.1 U1.7(PB6)
N$35: IC3.9(QH*) IC6.14(SER)
N$36: IC6.15(QA) R49.1
N$37: IC5.15(QA) R28.1
N$38: IC5.1(QB) R29.1
N$39: IC5.2(QC) R30.1
N$40: IC5.3(QD) R31.1
N$41: IC5.4(QE) R32.1
N$42: IC5.5(QF) R33.1
N$43: IC5.6(QG) R34.1
N$44: IC5.7(QH) R35.1
N$45: Q2.1(G) R28.2
N$46: Q3.1(G) R29.2
N$47: Q4.1(G) R30.2
N$48: Q5.1(G) R31.2
N$49: Q6.1(G) R32.2
N$50: Q7.1(G) R33.2
N$51: Q8.1(G) R34.2
N$52: Q9.1(G) R35.2
N$53: IC6.1(QB) R50.1
N$54: IC6.2(QC) R51.1
N$55: IC6.3(QD) R52.1
N$56: IC6.4(QE) R53.1
N$57: IC6.5(QF) R54.1
N$58: IC6.6(QG) R55.1
N$59: IC6.7(QH) R56.1
N$60: IC5.14(SER) IC6.9(QH*)
N$61: IC7.15(QA) R57.1
N$62: IC7.1(QB) R58.1
N$63: IC7.2(QC) R59.1
N$64: IC7.3(QD) R60.1
N$69: C4.1 IC4.2(!DTR)
N$70: Q10.1(G) R57.2
N$71: Q11.1(G) R58.2
N$72: Q12.1(G) R59.2
N$73: Q13.1(G) R60.2
N$78: IC5.9(QH*) IC7.14(SER)
POT: BRIGHT.2(S) U1.28(PC5)
RCK: IC1.12(RCK) IC2.12(RCK) IC3.12(RCK) IC5.12(RCK) IC6.12(RCK) IC7.12(RCK) R46.2 U1.2(PD4)
SCK: IC1.11(SCK) IC2.11(SCK) IC3.11(SCK) IC5.11(SCK) IC6.11(SCK) IC7.11(SCK) R45.2 U1.1(PD3)
SER: IC1.14(SER) R44.2 U1.10(PD6)
SPEED: POT2.2(S) U1.27(PC4)
SPI_SCK: ISP1.3(SCK) U1.17(PB5)
VCC: BRIGHT.3(E) C1.1 C2.1 C3.1 C7.1 C8.1 C9.1 C10.+ C12.1 C13.1 CN1.VBUS IC1.10(SCL) IC1.16(VCC) IC2.10(SCL) IC2.16(VCC) IC3.10(SCL) IC3.16(VCC) IC4.4(VCCIO) IC4.19(!RESET) IC4.20(VCC) IC5.10(SCL) IC5.16(VCC) IC6.10(SCL) IC6.16(VCC) IC7.10(SCL) IC7.16(VCC) ISP1.2(VCC) POT2.3(E) R25.2 R26.2 R27.2 R48.2 U1.4(VCC) U1.6(VCC) U1.18(AVCC)
X1: LED1.C LED2.C LED3.C LED4.C LED5.C LED6.C LED7.C LED8.C LED9.C LED10.C LED11.C LED12.C LED13.C LED14.C LED15.C LED16.C LED17.C LED18.C LED19.C LED20.C LED21.C LED22.C LED23.C LED24.C LED25.C LED26.C LED27.C LED28.C LED29.C LED30.C LED31.C LED32.C Q2.3(D)
X2: LED33.C LED34.C LED35.C LED36.C LED37.C LED38.C LED39.C LED40.C LED41.C LED42.C LED43.C LED44.C LED45.C LED46.C LED47.C LED48.C LED49.C LED50.C LED51.C LED52.C LED53.C LED54.C LED55.C LED56.C LED57.C LED58.C LED59.C LED60.C LED61.C LED62.C LED63.C LED64.C Q3.3(D)
X3: LED65.C LED66.C LED67.C LED68.C LED69.C LED70.C LED71.C LED72.C LED73.C LED74.C LED75.C LED76.C LED77.C LED78.C LED79.C LED80.C LED81.C LED82.C LED83.C LED84.C LED85.C LED86.C LED87.C LED88.C LED89.C LED90.C LED91.C LED92.C LED93.C LED94.C LED95.C LED96.C Q4.3(D)
X4: LED97.C LED98.C LED99.C LED100.C LED101.C LED102.C LED103.C LED104.C LED105.C LED106.C LED107.C LED108.C LED109.C LED110.C LED111.C LED112.C LED113.C LED114.C LED115.C LED116.C LED117.C LED118.C LED119.C LED120.C LED121.C LED122.C LED123.C LED124.C LED125.C LED126.C LED127.C LED128.C Q5.3(D)
X5: LED129.C LED130.C LED131.C LED132.C LED133.C LED134.C LED135.C LED136.C LED137.C LED138.C LED139.C LED140.C LED141.C LED142.C LED143.C LED144.C LED145.C LED146.C LED147.C LED148.C LED149.C LED150.C LED151.C LED152.C LED153.C LED154.C LED155.C LED156.C LED157.C LED158.C LED159.C LED160.C Q6.3(D)
X6: LED161.C LED162.C LED163.C LED164.C LED165.C LED166.C LED167.C LED168.C LED169.C LED170.C LED171.C LED172.C LED173.C LED174.C LED175.C LED176.C LED177.C LED178.C LED179.C LED180.C LED181.C LED182.C LED183.C LED184.C LED185.C LED186.C LED187.C LED188.C LED189.C LED190.C LED191.C LED192.C Q7.3(D)
X7: LED193.C LED194.C LED195.C LED196.C LED197.C LED198.C LED199.C LED200.C LED201.C LED202.C LED203.C LED204.C LED205.C LED206.C LED207.C LED208.C LED209.C LED210.C LED211.C LED212.C LED213.C LED214.C LED215.C LED216.C LED217.C LED218.C LED219.C LED220.C LED221.C LED222.C LED223.C LED224.C Q8.3(D)
X8: LED225.C LED226.C LED227.C LED228.C LED229.C LED230.C LED231.C LED232.C LED233.C LED234.C LED235.C LED236.C LED237.C LED238.C LED239.C LED240.C LED241.C LED242.C LED243.C LED244.C LED245.C LED246.C LED247.C LED248.C LED249.C LED250.C LED251.C LED252.C LED253.C LED254.C LED255.C LED256.C Q9.3(D)
X9: LED257.C LED258.C LED259.C LED260.C LED261.C LED262.C LED263.C LED264.C LED265.C LED266.C LED267.C LED268.C LED269.C LED270.C LED271.C LED272.C LED273.C LED274.C LED275.C LED276.C LED277.C LED278.C LED279.C LED280.C LED281.C LED282.C LED283.C LED284.C LED285.C LED286.C LED287.C LED288.C Q10.3(D)
X10: LED289.C LED290.C LED291.C LED292.C LED293.C LED294.C LED295.C LED296.C LED297.C LED298.C LED299.C LED300.C LED301.C LED302.C LED303.C LED304.C LED305.C LED306.C LED307.C LED308.C LED309.C LED310.C LED311.C LED312.C LED313.C LED314.C LED315.C LED316.C LED317.C LED318.C LED319.C LED320.C Q11.3(D)
X11: LED321.C LED322.C LED323.C LED324.C LED325.C LED326.C LED327.C LED328.C LED329.C LED330.C LED331.C LED332.C LED333.C LED334.C LED335.C LED336.C LED337.C LED338.C LED339.C LED340.C LED341.C LED342.C LED343.C LED344.C LED345.C LED346.C LED347.C LED348.C LED349.C LED350.C LED351.C LED352.C Q12.3(D)
X12: LED353.C LED354.C LED355.C LED356.C LED357.C LED358.C LED359.C LED360.C LED361.C LED362.C LED363.C LED364.C LED365.C LED366.C LED367.C LED368.C LED369.C LED370.C LED371.C LED372.C LED373.C LED374.C LED375.C LED376.C LED377.C LED378.C LED379.C LED380.C LED381.C LED382.C LED383.C LED384.C Q13.3(D)
Unconnected: BTN.1(S) BTN.4(P1) CN1.ID IC4.3(!RTS) IC4.6(!RI) IC4.9(!DSR) IC4.10(!DCD) IC4.11(!CTS) IC4.12(CBUS4) IC4.13(CBUS2) IC4.14(CBUS3) IC4.17(3V3OUT) IC4.27(OSCI) IC4.28(OSCO) IC7.4(QE) IC7.5(QF) IC7.6(QG) IC7.7(QH) IC7.9(QH*) RCK.2(S1) RCK.4(P1) RES.2(S1) RES.4(P1) SCK.2(S1) SCK.4(P1) SER.2(S1) SER.4(P1) U1.19(ADC6) U1.20(AREF) U1.22(ADC7) U1.23(PC0) U1.24(PC1) U1.25(PC2) U1.26(PC3)

## Library data of the parts
BRIGHT POT2 = adafruit:TRIMPOT: SMT trimmer potentiometer part number TC33X http://www.ladyada.net/library/eagle
BTN RCK RES SCK SER = switch-omron:10-XX: OMRON SWITCH; MPN: B3F-1000; OC_FARNELL: 176432; OC_NEWARK: 36M3542
C1-C3 C7-C9 C12 C13 = adafruit:C-US: CAPACITOR, American symbol
C4-C6 = rcl:C-US: CAPACITOR, American symbol; SPICEPREFIX: C
C10 = rcl:CPOL-US: POLARIZED CAPACITOR, American symbol; SPICEPREFIX: C
CN1 = adafruit:USB: USB Connectors USBMINIB - Surface Mount Female Mini-B USB Connector 4UConnector: 06564 By microbuilder.eu Thru-hole RA Female Mini-B USB Connector 4UConnector: 18732 By ladyada.net
H1-H3 = holes:MOUNT-HOLE: MOUNTING HOLE with drill center marker
IC1-IC3 IC5-IC7 = 74xx-eu:74*595: 8-bit SHIFT REGISTER, output latch
IC4 = ftdichip:FT232R: Source: http://www.ftdichip.com/Documents/DataSheets/DS_FT232R_v104.pdf; MPN: FT232RL; OC_FARNELL: 1146032; OC_NEWARK: 91K9918
ISP1 = adafruit:AVRISP: AVR ISP HEADER Standard 6 pin header for AVR programming
LED1-LED384 RX TX = adafruit:LED: LED OSRAM: - CHIPLED LG R971, LG N971, LY N971, LG Q971, LY Q971, LO R971, LY R971 LH N974, LH R974 LS Q976, LO Q976, LY Q976 LO Q996 - Hyper CHIPLED LW Q18S LB Q993, LB Q99A, LB R99A - SideLED LS A670, LO A670, LY A670, LG A670, LP A670 LB A673, LV A673, LT A673, LW A673 LH A674 LY A675 LS A676, LA A676, LO A676, LY A676, LW A676 LS A679, LY A679, LG A679 - Hyper Micro SIDELED® LS Y876, LA Y876, LO Y876, LY Y876 LT Y87S - SmartLED LW L88C, LW L88S LB L89C, LB L89S, LG L890 LS L89K, LO L89K, LY L89K LS L896, LA L896, LO L896, LY L896 - TOPLED LS T670, LO T670, LY T670, LG T670, LP T670 LSG T670, LSP T670, LSY T670, LOP T670, LYG T670 LG T671, LOG T671, LSG T671 LB T673, LV T673, LT T673, LW T673 LH T674 LS T676, LA T676, LO T676, LY T676, LB T676, LH T676, LSB T676, LW T676 LB T67C, LV T67C, LT T67C, LS T67K, LO T67K, LY T67K, LW E67C LS E67B, LA E67B, LO E67B, LY E67B, LB E67C, LV E67C, LT E67C LW T67C LS T679, LY T679, LG T679 LS T770, LO T770, LY T770, LG T770, LP T770 LB T773, LV T773, LT T773, LW T773 LH T774 LS E675, LA E675, LY E675, LS T675 LS T776, LA T776, LO T776, LY T776, LB T776 LHGB T686 LT T68C, LB T68C - Hyper Mini TOPLED® LB M676 - Mini TOPLED Santana® LG M470 LS M47K, LO M47K, LY M47K Source: http://www.osram.convergy.de/
PAUSE = pinhead:PINHD-1X2: PIN HEADER
Q1 = special:XTAL/S: CRYSTAL
Q2-Q13 = adafruit:MOSFET-N: N-Channel Mosfet 2N7002E - 60V 260mA SOT23 [Digikey: 2N7002ET1GOSTR-ND] - REEL BSH103 - 30V 850mA SOT23 [Digikey: 568-5013-1-ND]
R1-R24 R28-R35 R49-R60 = adafruit:R-US_: RESISTOR, American symbol
R25-R27 R44-R48 = rcl:R-US_: RESISTOR, American symbol; SPICEPREFIX: R
SV2 = con-lstb:MA03-1: PIN HEADER; OC_FARNELL: unknown; OC_NEWARK: unknown
U1 = ATMEGA328P-AU:ATMEGA328P-AU: ATmega Series 20 MHz 32 KB Flash 2 KB SRAM 8-Bit Microcontroller - TQFP-32 Check prices <https://pricing.snapeda.com/parts/ATMEGA328P-AU/Microchip%20Technology/view-part?ref=eda>; AVAILABILITY: Warning; DESCRIPTION: AVR AVR® ATmega Microcontroller IC 8-Bit 20MHz 32KB (16K x 16) FLASH 32-TQFP (7x7); MF: Microchip Technology; MP: ATMEGA328P-AU; PACKAGE: TQFP-32 Microchip; PRICE: None; PURCHASE-URL: https://pricing.snapeda.com/search/part/ATMEGA328P-AU/?ref=eda